# Altium schematic sheet Pad.SchDoc
size B; CompanyName: Microchip Technology Inc.; Organization: Microchip Technology; Address1: 2355 West Chandler Blvd.; Address2: Chandler, AZ  85224; Address4: USA; SheetNumber: 3; SheetTotal: 3; SheetTitle: **; Time: Time
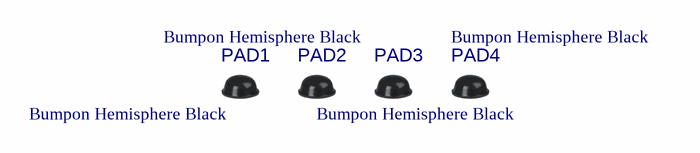
[diagram p0: Pad.SchDoc]

## Parts
PAD1  value Bumpon Hemisphere Black  [BUMP_3M_SJ5000_CYLINDRICAL_BLACK_D11.18H5]  (hidden comment: Rubber Pad Hemisphere)
PAD2  value Bumpon Hemisphere Black  [BUMP_3M_SJ5000_CYLINDRICAL_BLACK_D11.18H5]  (hidden comment: Rubber Pad Hemisphere)
PAD3  value Bumpon Hemisphere Black  [BUMP_3M_SJ5000_CYLINDRICAL_BLACK_D11.18H5]  (hidden comment: Rubber Pad Hemisphere)
PAD4  value Bumpon Hemisphere Black  [BUMP_3M_SJ5000_CYLINDRICAL_BLACK_D11.18H5]  (hidden comment: Rubber Pad Hemisphere)

## Notes on the sheet
- Project Owner:
- PCB Layout Contact:
- PartNumber:
- Project Title
- Variant:
- Sheet Title
- Size
- B
- SCH #:
- PCB #:
- Rev:
- Date:
- Sheet
- Designed with
- Altium.com <http://go.altium.com/MicrochipLandingPage_Evaluation.html>
- File:

## Library data of the parts
PAD1-PAD4 = HW1102: Manufacturer 1: 3M; Manufacturer Part Number 1: SJ-5003 (BLACK); MCHP-ID: HW1102; Description_: MECH HW RUBBER PAD Bumpon Hemisphere 0.44" x 0.20" Black; Dev Tools Status: Production; Owner: Tim Moffat; Populated: MECH; Revision: 0; Symbol: Rubber Pad Hemisphere; Status: MCL Design; ComponentLink1URL: https://chn-vm-apps.microchip.com/mchprepo/parts/Datasheets/SJ-5003.pdf; ComponentLink1Description: SVN Datasheet; ComponentLink2URL: C:\ALTIUM_WORK\00001_MCHP-CDB\Datasheets\SJ-5003.pdf; ComponentLink2Description: Local Datasheet; ComponentLink3URL: C:\ALTIUM_WORK\00001_MCHP-CDB\Library\LibraryRefs\Rubber Pad Hemisphere.SchLib; ComponentLink3Description: Open Symbol; ComponentLink4URL: C:\ALTIUM_WORK\00001_MCHP-CDB\Library\Footprints\BUMP_3M_SJ5000_CYLINDRICAL_BLACK_D11.18H5.PcbLib; ComponentLink4Description: Open Footprint; ComponentLink5Description: Open Footprint 2; ComponentLink6Description: Open Footprint 3; ComponentLink7Description: Open Footprint 4; Type: Rubber Pad; Category: Hardware; Supplier 1: Digi-Key; Supplier Part Number 1: SJ5003-0-ND; Quantity Override: 1